# EAGLE design homecomputer-6502 (EAGLE 6.5.0)

## Sheet 1 of 4
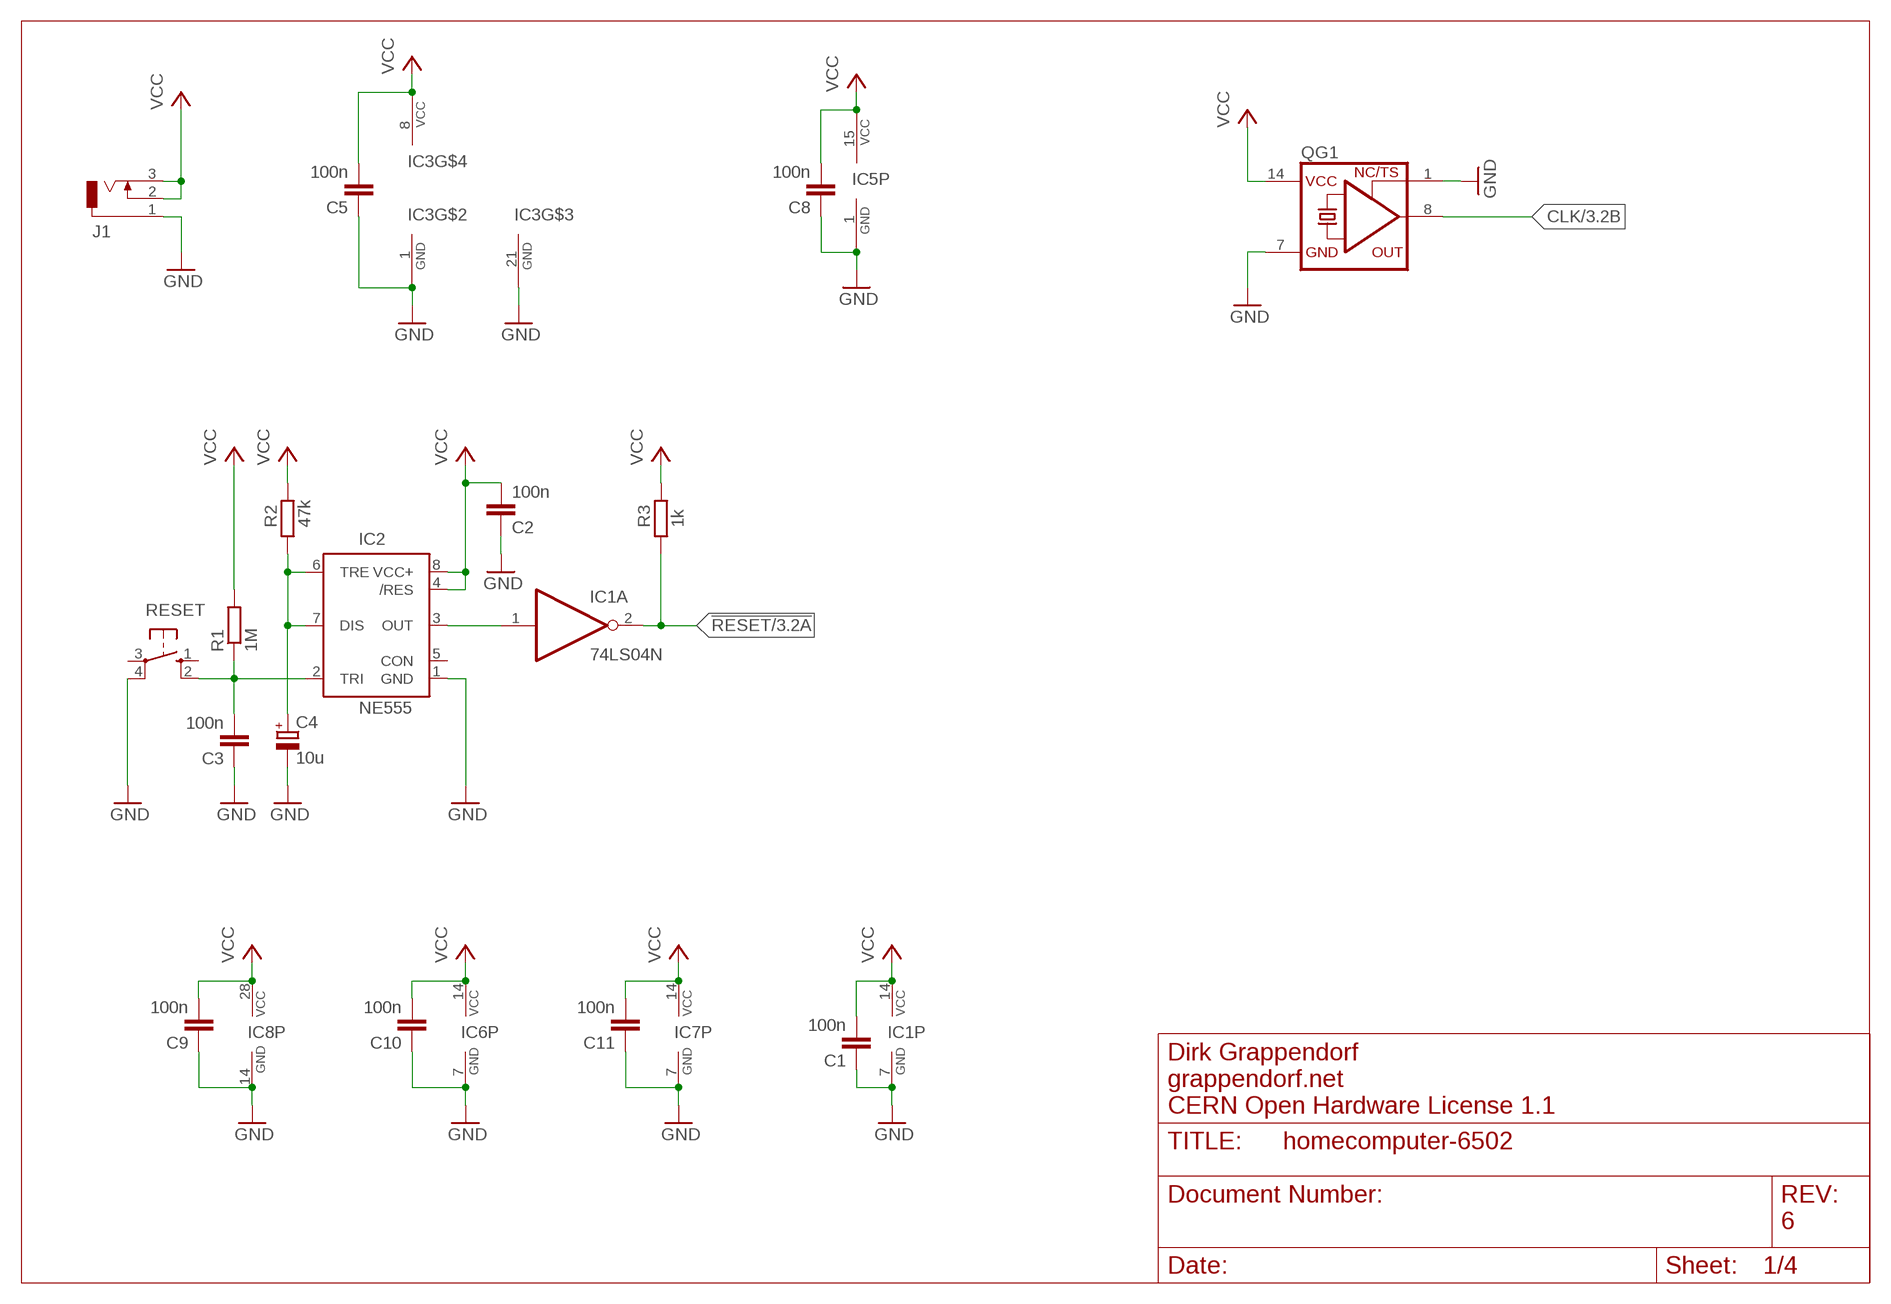
[diagram p0: schematic, sheet 1]

### Parts
C1  100n  C-EU025-024X044  [C025-024X044]
C2  100n  C-EU025-024X044  [C025-024X044]
C3  100n  C-EU025-024X044  [C025-024X044]
C4  10u  CPOL-EUE2,5-6E  [E2,5-6E]
C5  100n  C-EU025-024X044  [C025-024X044]
C8  100n  C-EU025-024X044  [C025-024X044]
C9  100n  C-EU025-024X044  [C025-024X044]
C10  100n  C-EU025-024X044  [C025-024X044]
C11  100n  C-EU025-024X044  [C025-024X044]
IC1  74LS04N  [DIL14]
IC2  NE555  [DIL-08]
IC3  6502  [DIP40]
IC5  6551  [DIP28]
IC6  74LS00N  [DIL14]
IC7  74LS30N  [DIL14]
IC8  61256  [DIL28-3]
J1  DCJ0303  [DCJ0303]
QG1  XO-14  [DIL14S]
R1  1M  R-EU_0204/5  [0204/5]
R2  47k  R-EU_0204/5  [0204/5]
R3  1k  R-EU_0204/5  [0204/5]
RESET  10-XX  [B3F-10XX]

### Nets
!RESET: IC1.2(A:O) R3.1 ; also sheet 3,4
CLK: QG1.8(OUT) ; also sheet 3
GND: C1.1 C2.1 C3.1 C4.- C5.1 C8.1 C9.1 C10.1 C11.1 IC1.7(P:GND) IC2.1(GND) IC3.1(GND) IC3.21(GND) IC5.1(GND) IC6.7(P:GND) IC7.7(GND) IC8.14(GND) J1.1 QG1.1(TS) QG1.7(GND) RESET.4(P1) ; also sheet 3,4
N$4: C4.+ IC2.6(TRE) IC2.7(DIS) R2.1
N$5: IC1.1(A:I) IC2.3(OUT)
N$6: C3.2 IC2.2(TRI) R1.1 RESET.2(S1)
VCC: C1.2 C2.2 C5.2 C8.2 C9.2 C10.2 C11.2 IC1.14(P:VCC) IC2.4(/RES) IC2.8(VCC+) IC3.8(VCC) IC5.15(VCC) IC6.14(P:VCC) IC7.14(VCC) IC8.28(VCC) J1.2 J1.3 QG1.14(VCC) R1.2 R2.2 R3.2 ; also sheet 3,4
Unconnected: IC1.5(C:I) IC1.6(C:O) IC1.8(D:O) IC1.9(D:I) IC1.12(F:O) IC1.13(F:I) IC2.5(CON) IC6.8(C:O) IC6.9(C:I0) IC6.10(C:I1) IC6.11(D:O) IC6.12(D:I0) IC6.13(D:I1) RESET.1(S) RESET.3(P)

### Notes on the sheet
- Dirk Grappendorf
- grappendorf.net
- CERN Open Hardware License 1.1
- 6

## Sheet 2 of 4
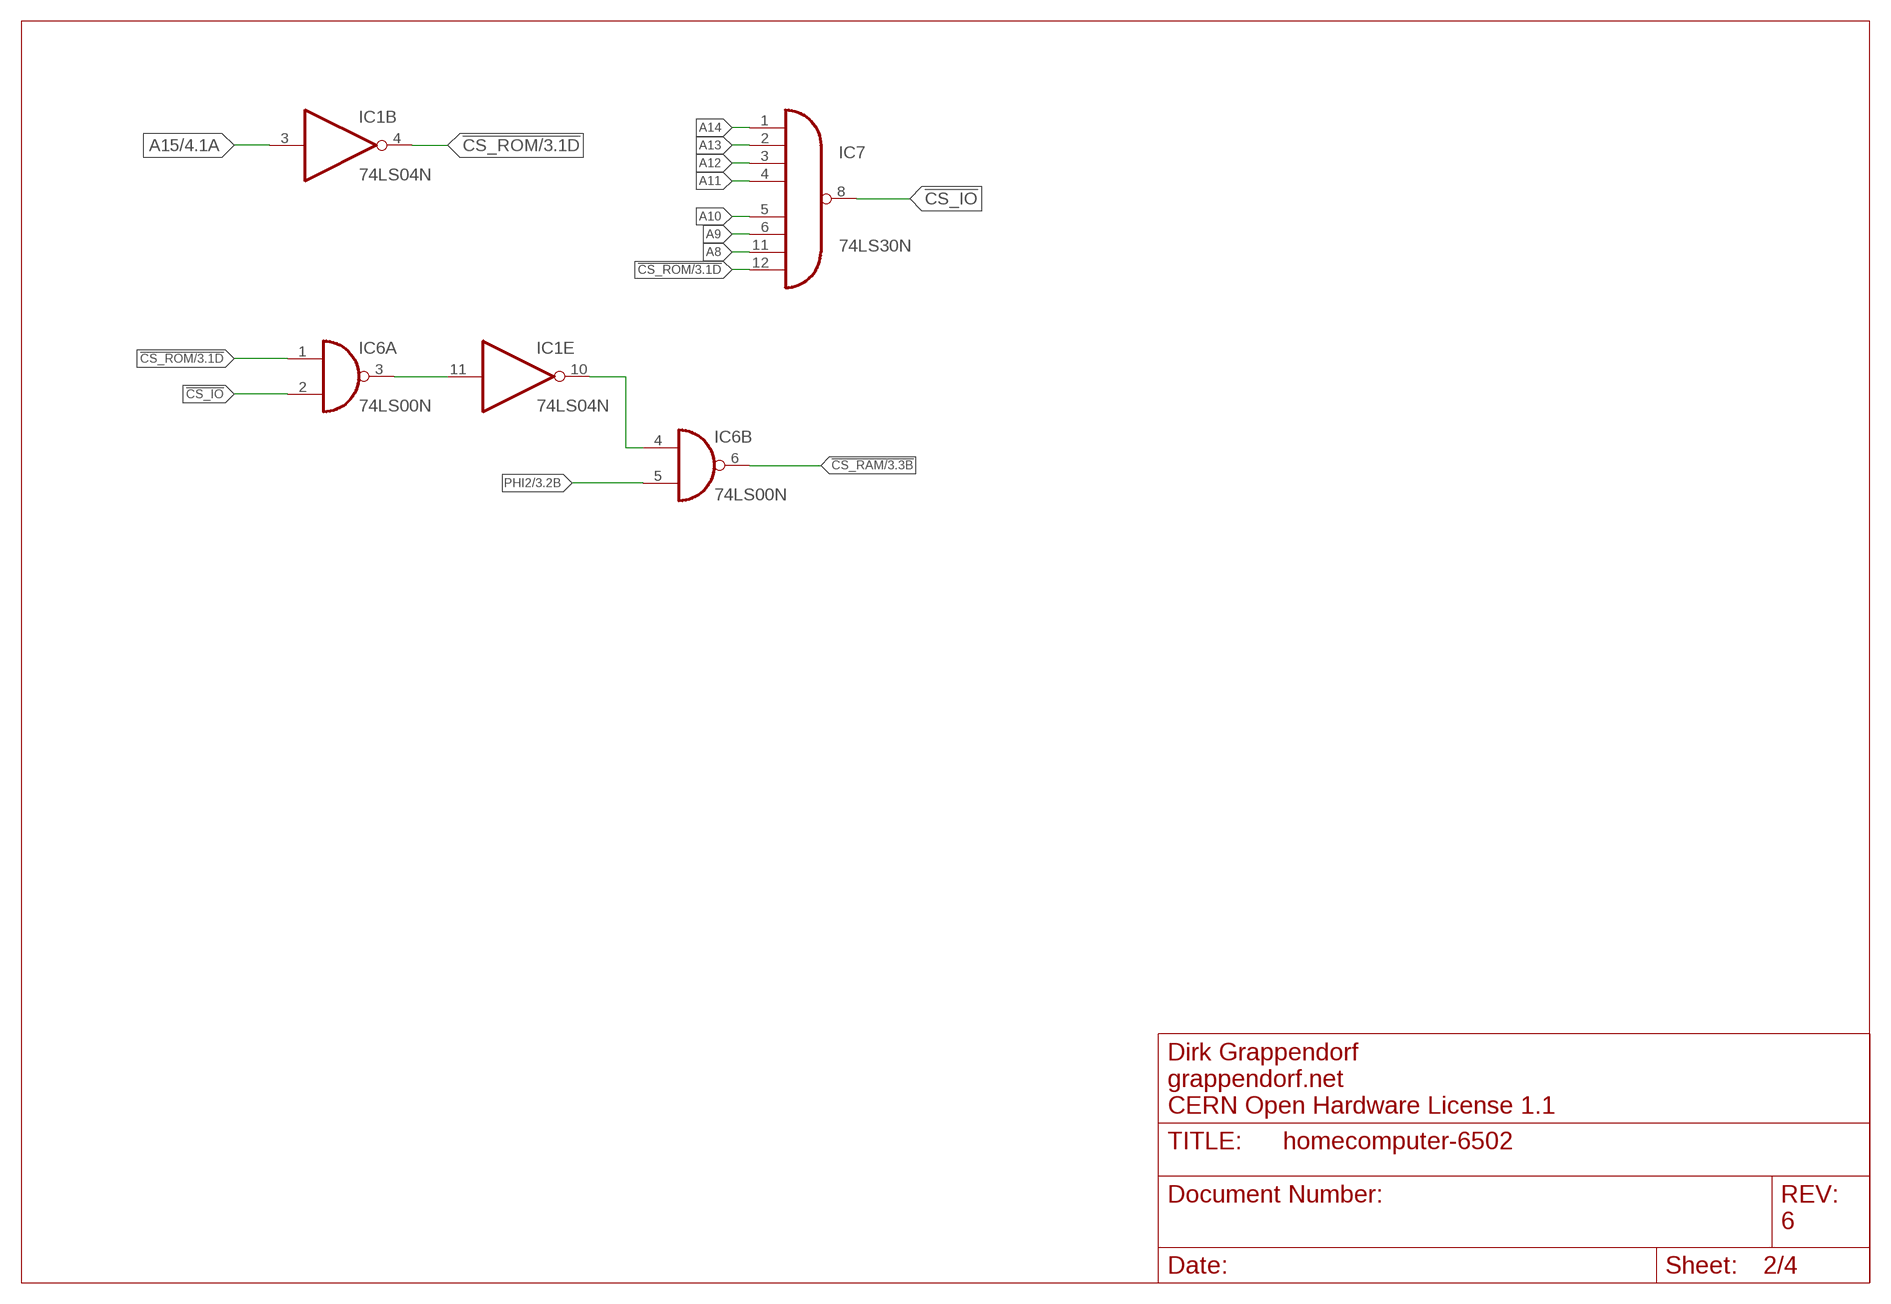
[diagram p1: schematic, sheet 2]

### Nets
!CS_IO: IC6.2(A:I1) IC7.8(O)
!CS_RAM: IC6.6(B:O) ; also sheet 3
!CS_ROM: IC1.4(B:O) IC6.1(A:I0) IC7.12(I7) ; also sheet 3
A8: IC7.11(I6) ; also sheet 3
A9: IC7.6(I5) ; also sheet 3
A10: IC7.5(I4) ; also sheet 3
A11: IC7.4(I3) ; also sheet 3
A12: IC7.3(I2) ; also sheet 3
A13: IC7.2(I1) ; also sheet 3
A14: IC7.1(I0) ; also sheet 3
A15: IC1.3(B:I) ; also sheet 3,4
N$14: IC1.11(E:I) IC6.3(A:O)
N$15: IC1.10(E:O) IC6.4(B:I0)
PHI2: IC6.5(B:I1) ; also sheet 3,4

### Notes on the sheet
- Dirk Grappendorf
- grappendorf.net
- CERN Open Hardware License 1.1
- 6

## Sheet 3 of 4
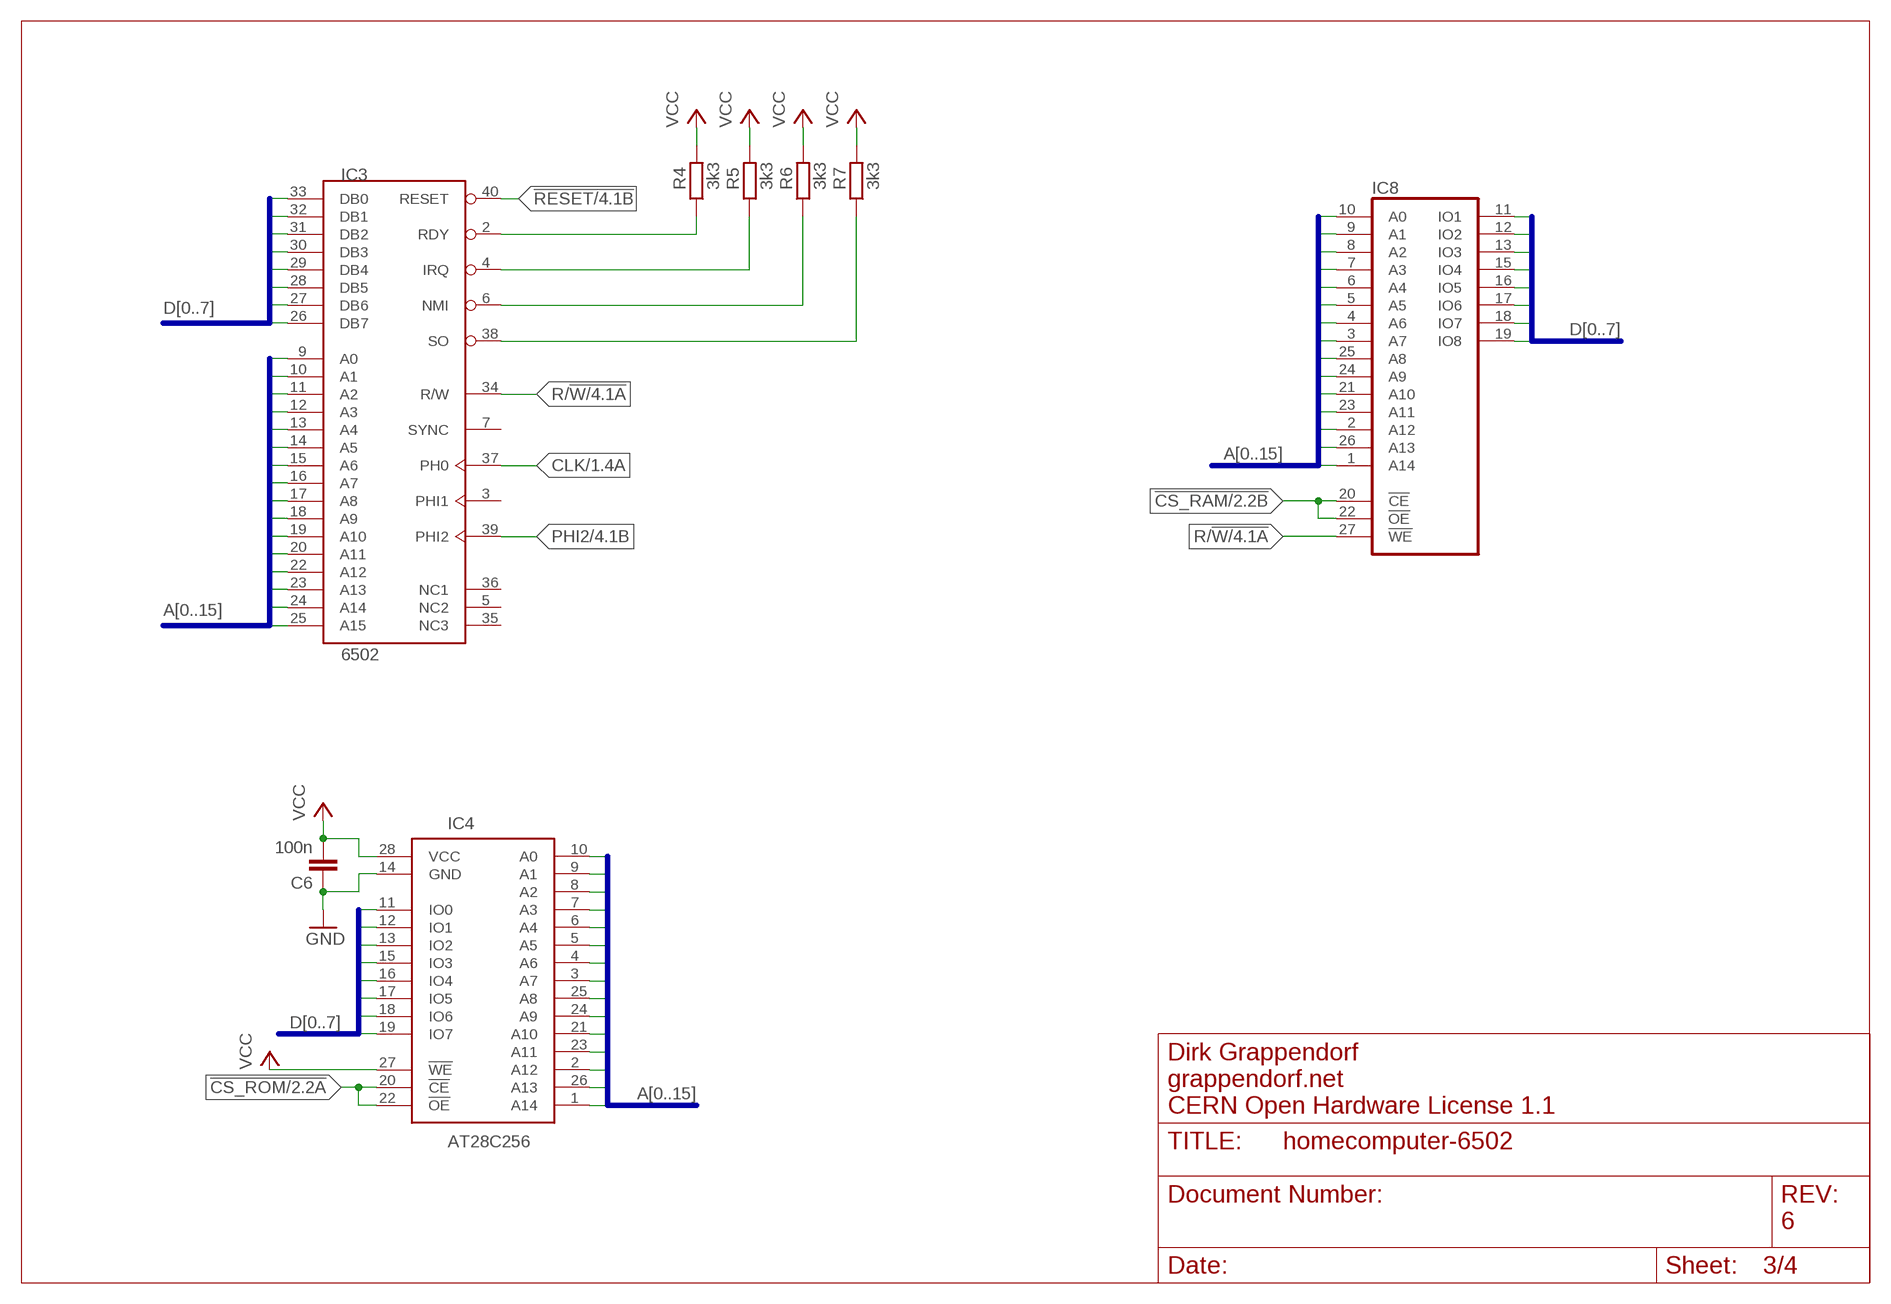
[diagram p2: schematic, sheet 3]

### Parts
C6  100n  C-EU025-024X044  [C025-024X044]
IC4  AT28C256  [DIL28-6]
R4  3k3  R-EU_0204/5  [0204/5]
R5  3k3  R-EU_0204/5  [0204/5]
R6  3k3  R-EU_0204/5  [0204/5]
R7  3k3  R-EU_0204/5  [0204/5]

### Nets
!CS_RAM: IC8.20(!CE) IC8.22(!OE) ; also sheet 2
!CS_ROM: IC4.20(!CE) IC4.22(!OE) ; also sheet 2
!RESET: IC3.40(RESET) ; also sheet 1,4
A0: IC3.9(A0) IC4.10(A0) IC8.10(A0) ; also sheet 4
A1: IC3.10(A1) IC4.9(A1) IC8.9(A1) ; also sheet 4
A2: IC3.11(A2) IC4.8(A2) IC8.8(A2)
A3: IC3.12(A3) IC4.7(A3) IC8.7(A3)
A4: IC3.13(A4) IC4.6(A4) IC8.6(A4)
A5: IC3.14(A5) IC4.5(A5) IC8.5(A5)
A6: IC3.15(A6) IC4.4(A6) IC8.4(A6)
A7: IC3.16(A7) IC4.3(A7) IC8.3(A7)
A8: IC3.17(A8) IC4.25(A8) IC8.25(A8) ; also sheet 2
A9: IC3.18(A9) IC4.24(A9) IC8.24(A9) ; also sheet 2
A10: IC3.19(A10) IC4.21(A10) IC8.21(A10) ; also sheet 2
A11: IC3.20(A11) IC4.23(A11) IC8.23(A11) ; also sheet 2
A12: IC3.22(A12) IC4.2(A12) IC8.2(A12) ; also sheet 2
A13: IC3.23(A13) IC4.26(A13) IC8.26(A13) ; also sheet 2
A14: IC3.24(A14) IC4.1(A14) IC8.1(A14) ; also sheet 2
A15: IC3.25(A15) ; also sheet 2,4
CLK: IC3.37(PH0) ; also sheet 1
D0: IC3.33(DB0) IC4.11(IO0) IC8.11(IO1) ; also sheet 4
D1: IC3.32(DB1) IC4.12(IO1) IC8.12(IO2) ; also sheet 4
D2: IC3.31(DB2) IC4.13(IO2) IC8.13(IO3) ; also sheet 4
D3: IC3.30(DB3) IC4.15(IO3) IC8.15(IO4) ; also sheet 4
D4: IC3.29(DB4) IC4.16(IO4) IC8.16(IO5) ; also sheet 4
D5: IC3.28(DB5) IC4.17(IO5) IC8.17(IO6) ; also sheet 4
D6: IC3.27(DB6) IC4.18(IO6) IC8.18(IO7) ; also sheet 4
D7: IC3.26(DB7) IC4.19(IO7) IC8.19(IO8) ; also sheet 4
GND: C6.1 IC4.14(GND) ; also sheet 1,4
N$3: IC3.2(RDY) R4.1
N$9: IC3.4(IRQ) R5.1
N$10: IC3.6(NMI) R6.1
N$11: IC3.38(SO) R7.1
PHI2: IC3.39(PHI2) ; also sheet 2,4
R/!W: IC3.34(R/W) IC8.27(!WE) ; also sheet 4
VCC: C6.2 IC4.27(!WE) IC4.28(VCC) R4.2 R5.2 R6.2 R7.2 ; also sheet 1,4
Unconnected: IC3.3(PHI1) IC3.5(NC2) IC3.7(SYNC) IC3.35(NC3) IC3.36(NC1)

### Buses
A[0..15]
D[0..7]

### Notes on the sheet
- Dirk Grappendorf
- grappendorf.net
- CERN Open Hardware License 1.1
- 6

## Sheet 4 of 4
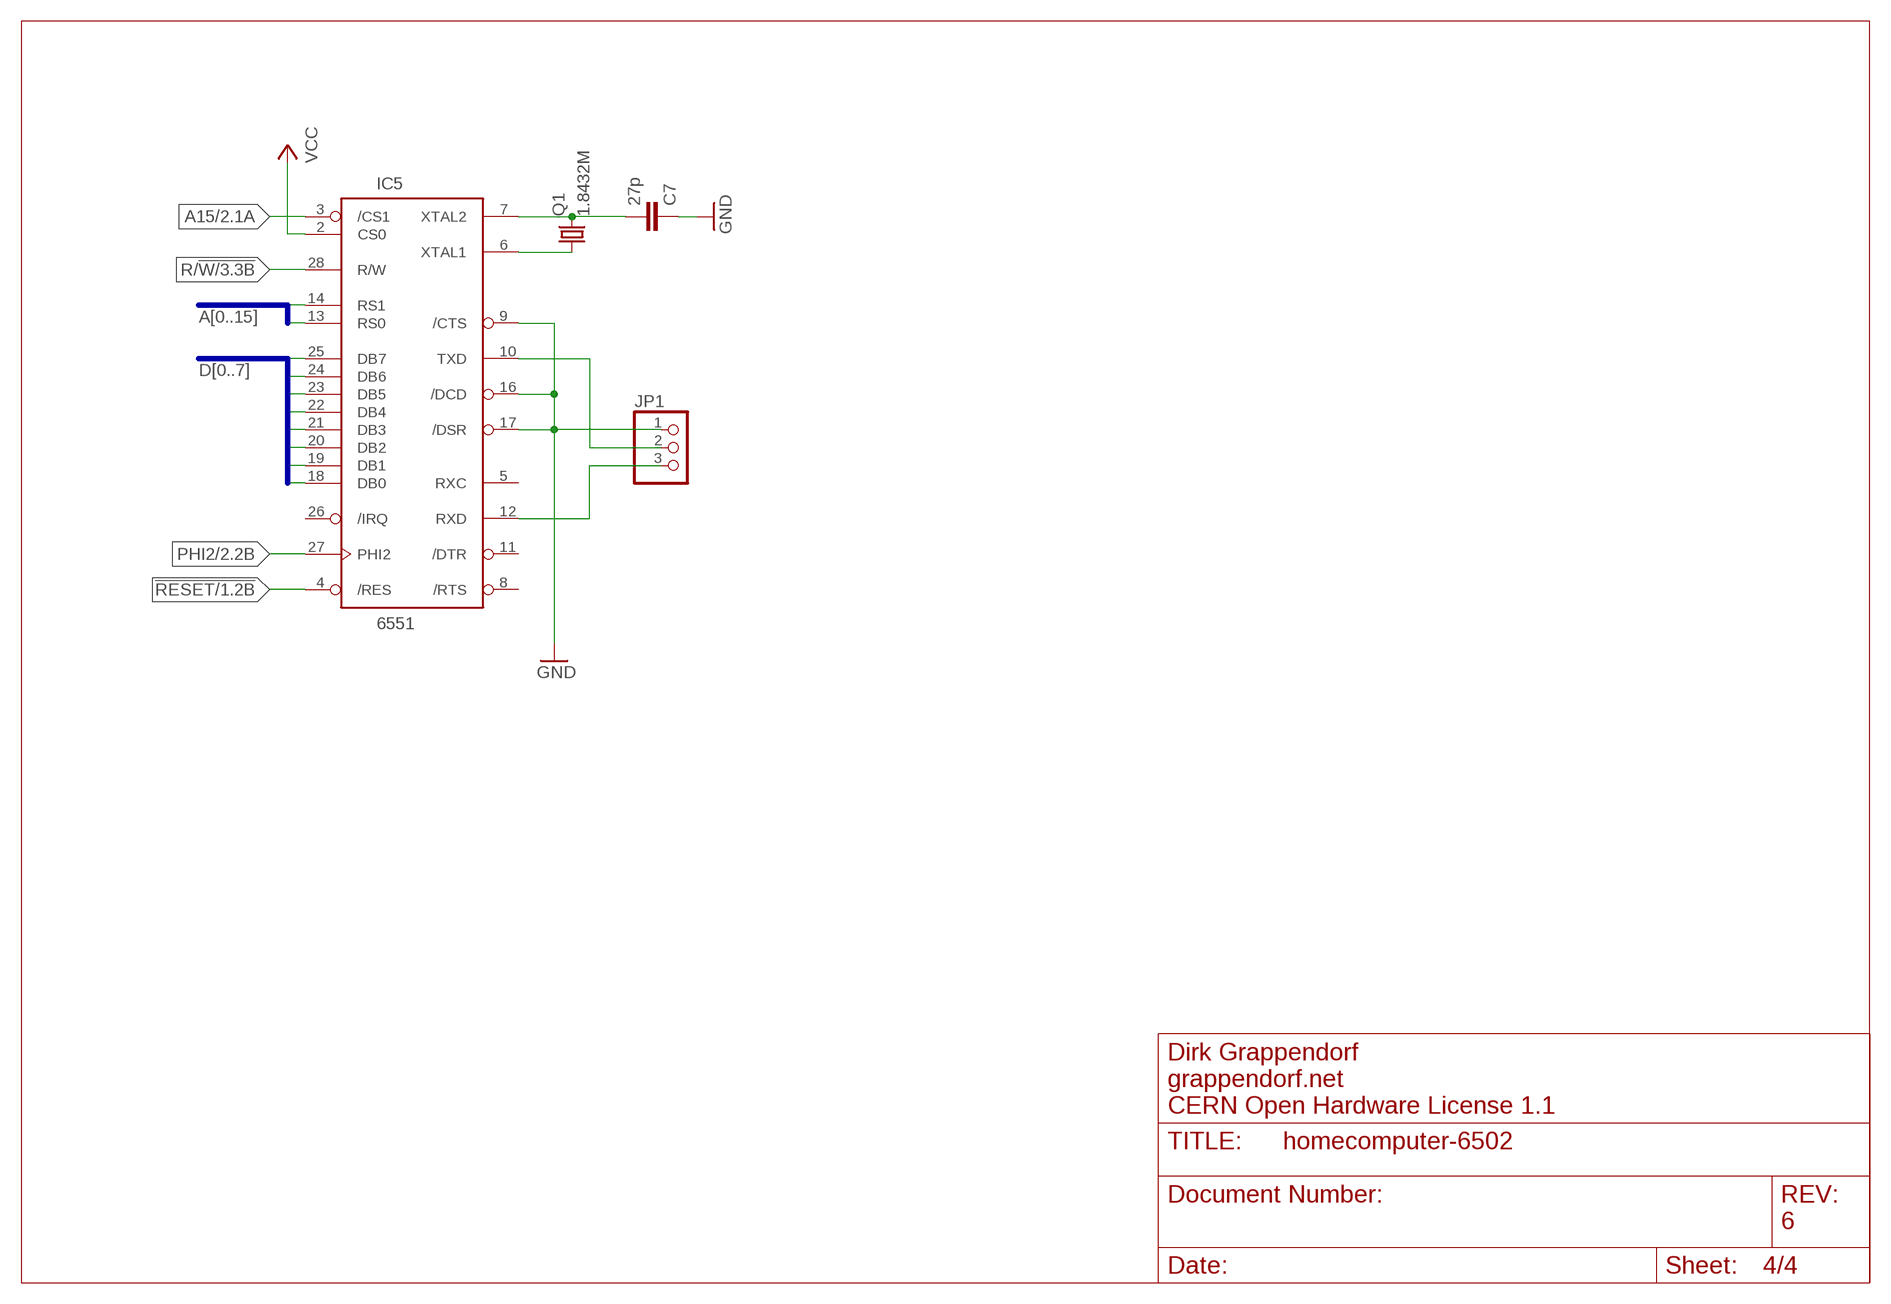
[diagram p3: schematic, sheet 4]

### Parts
C7  27p  C-EU025-024X044  [C025-024X044]
JP1  PINHD-1X3_2.54  [1X03]
Q1  1.8432M  CRYSTALHC49U-V  [HC49U-V]

### Nets
!RESET: IC5.4(/RES) ; also sheet 1,3
A0: IC5.13(RS0) ; also sheet 3
A1: IC5.14(RS1) ; also sheet 3
A15: IC5.3(/CS1) ; also sheet 2,3
D0: IC5.18(DB0) ; also sheet 3
D1: IC5.19(DB1) ; also sheet 3
D2: IC5.20(DB2) ; also sheet 3
D3: IC5.21(DB3) ; also sheet 3
D4: IC5.22(DB4) ; also sheet 3
D5: IC5.23(DB5) ; also sheet 3
D6: IC5.24(DB6) ; also sheet 3
D7: IC5.25(DB7) ; also sheet 3
GND: C7.1 IC5.9(/CTS) IC5.16(/DCD) IC5.17(/DSR) JP1.1 ; also sheet 1,3
N$1: C7.2 IC5.7(XTAL2) Q1.2
N$2: IC5.6(XTAL1) Q1.1
N$8: IC5.10(TXD) JP1.2
N$12: IC5.12(RXD) JP1.3
PHI2: IC5.27(PHI2) ; also sheet 2,3
R/!W: IC5.28(R/W) ; also sheet 3
VCC: IC5.2(CS0) ; also sheet 1,3
Unconnected: IC5.5(RXC) IC5.8(/RTS) IC5.11(/DTR) IC5.26(/IRQ)

### Buses
A[0..15]
D[0..7]

### Notes on the sheet
- Dirk Grappendorf
- grappendorf.net
- CERN Open Hardware License 1.1
- 6

## Library data of the parts
C1-C3 C5-C11 = rcl:C-EU: CAPACITOR, European symbol
C4 = rcl:CPOL-EU: POLARIZED CAPACITOR, European symbol
IC1 = 74xx-eu:74*04: Hex INVERTER
IC2 = st-microelectronics:NE555: General purpose bipolar Timer; MF: Arrow Electronics; MPN: NE555N; OC_FARNELL: 1467742; OC_NEWARK: 89K1486
IC3 = 6502:6502: 6502 processor
IC4 = atmel-28c:AT28C256: EEPROM 32Kx8 256k bit The AT28C256 is a high-performance Electrically Erasable and Programmable Read Only Memory. Its 256K of memory is organized as 32,768 words by 8 bits.
IC5 = 6502:6551: ACIA. Capable of RS-232
IC6 = 74xx-eu:74*00: Quad 2-input NAND gate
IC7 = 74xx-eu:74*30: 8-input NAND gate
IC8 = grapelabs:61256: MEMORY
J1 = con-jack:DCJ0303: DC POWER JACK Source: DCJ0303.pdf; OC_FARNELL: unknown; OC_NEWARK: unknown
JP1 = pinhead-1:PINHD-1X3: PIN HEADER
Q1 = crystal:CRYSTAL: CRYSTAL; OC_FARNELL: 1666969; OC_NEWARK: unknown
QG1 = crystal2:XO-: CRYSTAL
R1-R7 = rcl:R-EU_: RESISTOR, European symbol
RESET = switch-omron:10-XX: OMRON SWITCH; MPN: B3F-1000; OC_FARNELL: 176432; OC_NEWARK: 36M3542

## Board
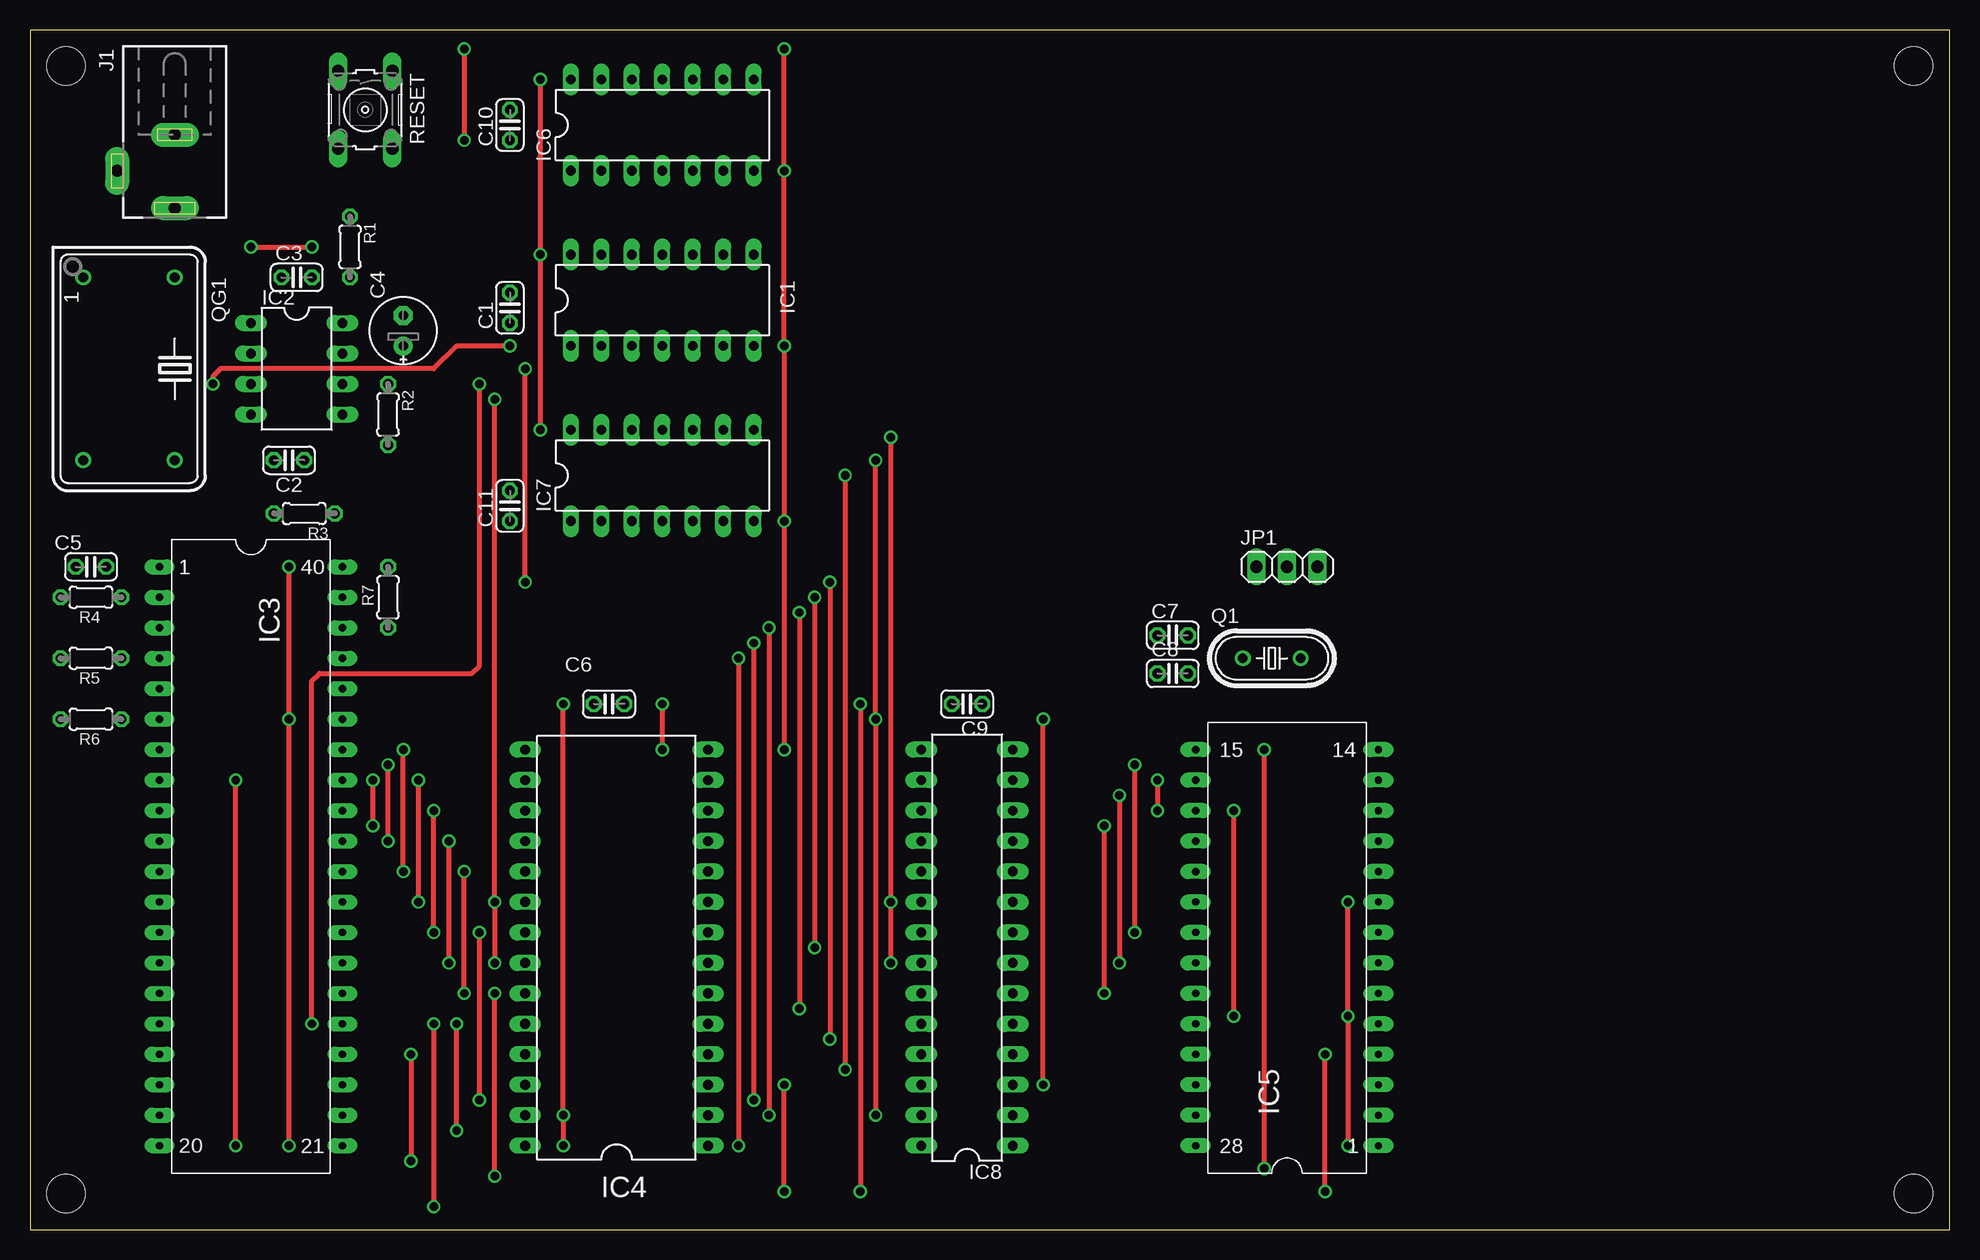
[diagram p4: board, top side]
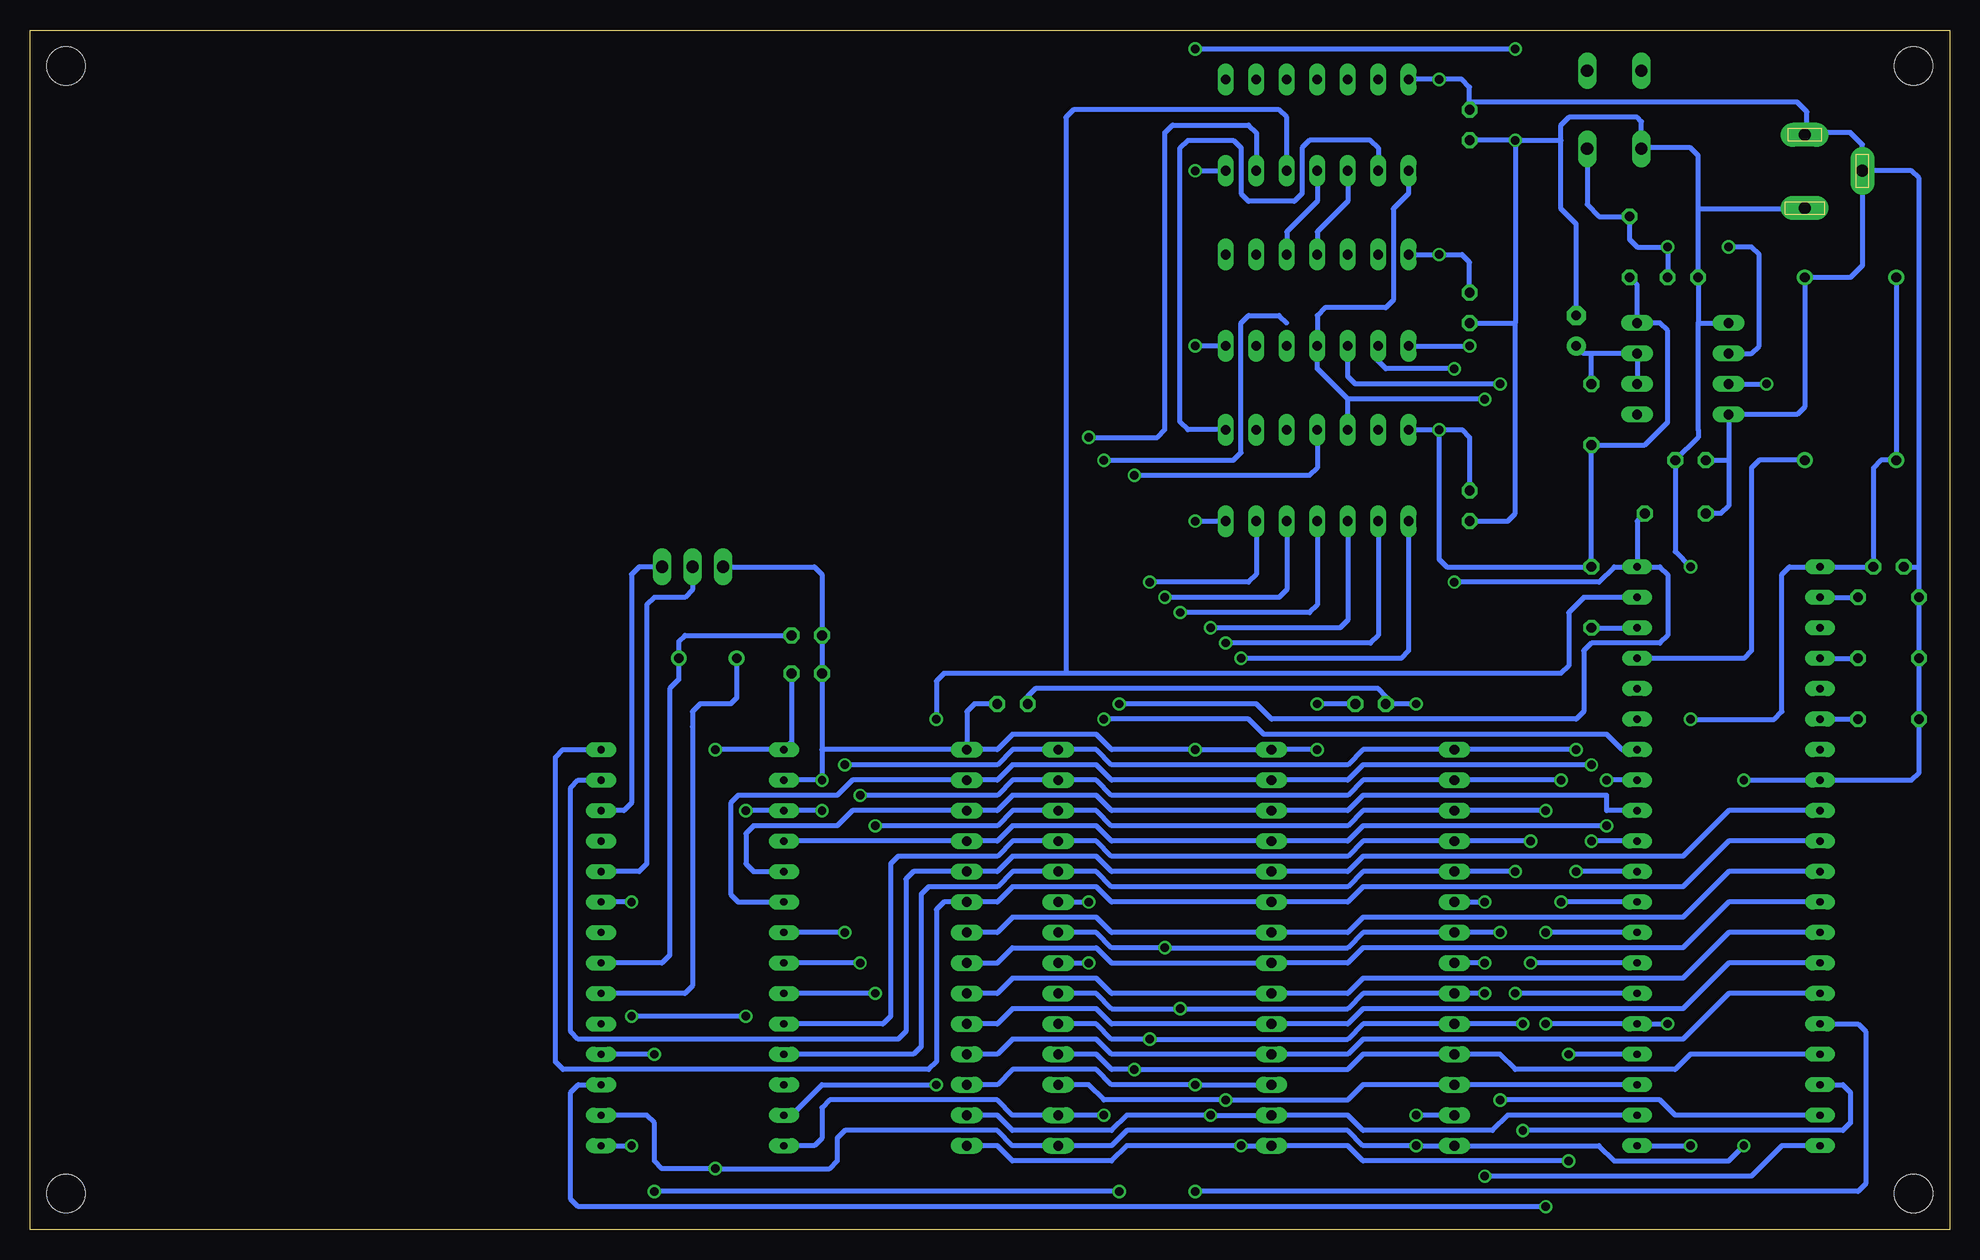
[diagram p5: board, bottom side, seen from below]

Size 160 x 100 mm. Coordinates in mm from the lower left corner, seen from the top.
Outline: 0,0 160,0 160,100 0,100 0,0
Copper layers (1*2*16): Top 0.035mm / dielectric 0.75mm / Route2 0.035mm / dielectric 0.75mm / Bottom 0.035mm
Design rules "default *": minimum track width 10mil, minimum drill 24mil, track to track 8mil, track to pad 8mil, pad to pad 8mil, via to via 8mil, smd to smd 8mil, copper to edge 40mil, drill to drill 8mil, minimum pad ring 10mil, minimum via ring 8mil, stop-mask expansion 4mil, vias tented up to drill 0mil, thermal gap 10mil
Holes 3.2 mm at 3,97 157,97 3,3 157,3

### Footprints (pad centres in the part's own frame; a part is rotated, then mirrored left to right if it is on the bottom)
C025-024X044 = drill 0.813 octagon: 1 -1.27,0; 2 1.27,0
E2,5-6E = drill 0.813 pad 1.575: + -1.27,0 | drill 0.813 pad 1.575 octagon: - 1.27,0
DIL14 = drill 0.813 long: 1 -7.62,-3.81; 2 -5.08,-3.81; 3 -2.54,-3.81; 4 0,-3.81; 5 2.54,-3.81; 6 5.08,-3.81; 7 7.62,-3.81; 8 7.62,3.81; 9 5.08,3.81; 10 2.54,3.81; 11 0,3.81; 12 -2.54,3.81; 13 -5.08,3.81; 14 -7.62,3.81
DIL-08 = drill 0.813 long: 1 -3.81,-3.81; 2 -1.27,-3.81; 3 1.27,-3.81; 4 3.81,-3.81; 5 3.81,3.81; 6 1.27,3.81; 7 -1.27,3.81; 8 -3.81,3.81
DIP40 = drill 0.61 pad 1.27 long: 1 -24.13,-7.62; 2 -21.59,-7.62; 3 -19.05,-7.62; 4 -16.51,-7.62; 5 -13.97,-7.62; 6 -11.43,-7.62; 7 -8.89,-7.62; 8 -6.35,-7.62; 9 -3.81,-7.62; 10 -1.27,-7.62; 11 1.27,-7.62; 12 3.81,-7.62; 13 6.35,-7.62; 14 8.89,-7.62; 15 11.43,-7.62; 16 13.97,-7.62; 17 16.51,-7.62; 18 19.05,-7.62; 19 21.59,-7.62; 20 24.13,-7.62; 21 24.13,7.62; 22 21.59,7.62; 23 19.05,7.62; 24 16.51,7.62; 25 13.97,7.62; 26 11.43,7.62; 27 8.89,7.62; 28 6.35,7.62; 29 3.81,7.62; 30 1.27,7.62; 31 -1.27,7.62; 32 -3.81,7.62; 33 -6.35,7.62; 34 -8.89,7.62; 35 -11.43,7.62; 36 -13.97,7.62; 37 -16.51,7.62; 38 -19.05,7.62; 39 -21.59,7.62; 40 -24.13,7.62
DIL28-6 = drill 0.813 long: 1 -16.51,-7.62; 2 -13.97,-7.62; 3 -11.43,-7.62; 4 -8.89,-7.62; 5 -6.35,-7.62; 6 -3.81,-7.62; 7 -1.27,-7.62; 8 1.27,-7.62; 9 3.81,-7.62; 10 6.35,-7.62; 11 8.89,-7.62; 12 11.43,-7.62; 13 13.97,-7.62; 14 16.51,-7.62; 15 16.51,7.62; 16 13.97,7.62; 17 11.43,7.62; 18 8.89,7.62; 19 6.35,7.62; 20 3.81,7.62; 21 1.27,7.62; 22 -1.27,7.62; 23 -3.81,7.62; 24 -6.35,7.62; 25 -8.89,7.62; 26 -11.43,7.62; 27 -13.97,7.62; 28 -16.51,7.62
DIP28 = drill 0.61 pad 1.27 long: 1 -16.51,-7.62; 2 -13.97,-7.62; 3 -11.43,-7.62; 4 -8.89,-7.62; 5 -6.35,-7.62; 6 -3.81,-7.62; 7 -1.27,-7.62; 8 1.27,-7.62; 9 3.81,-7.62; 10 6.35,-7.62; 11 8.89,-7.62; 12 11.43,-7.62; 13 13.97,-7.62; 14 16.51,-7.62; 15 16.51,7.62; 16 13.97,7.62; 17 11.43,7.62; 18 8.89,7.62; 19 6.35,7.62; 20 3.81,7.62; 21 1.27,7.62; 22 -1.27,7.62; 23 -3.81,7.62; 24 -6.35,7.62; 25 -8.89,7.62; 26 -11.43,7.62; 27 -13.97,7.62; 28 -16.51,7.62
DIL28-3 = drill 0.813 long: 1 -16.51,-3.81; 2 -13.97,-3.81; 3 -11.43,-3.81; 4 -8.89,-3.81; 5 -6.35,-3.81; 6 -3.81,-3.81; 7 -1.27,-3.81; 8 1.27,-3.81; 9 3.81,-3.81; 10 6.35,-3.81; 11 8.89,-3.81; 12 11.43,-3.81; 13 13.97,-3.81; 14 16.51,-3.81; 15 16.51,3.81; 16 13.97,3.81; 17 11.43,3.81; 18 8.89,3.81; 19 6.35,3.81; 20 3.81,3.81; 21 1.27,3.81; 22 -1.27,3.81; 23 -3.81,3.81; 24 -6.35,3.81; 25 -8.89,3.81; 26 -11.43,3.81; 27 -13.97,3.81; 28 -16.51,3.81
DCJ0303 = drill 1 pad 2 long: 1 0,3.1; 2 4.8,0; 3 0,-3
1X03 = drill 1.016 long: 1 -2.54,0; 2 0,0; 3 2.54,0
HC49U-V = drill 0.813: 1 -2.413,0; 2 2.413,0
DIL14S = drill 0.813: 1 -7.62,-3.81; 7 7.62,-3.81; 8 7.62,3.81; 14 -7.62,3.81
0204/5 = drill 0.813 octagon: 1 -2.54,0; 2 2.54,0
B3F-10XX = drill 1.016 long: 1 -3.251,2.261; 2 3.251,2.261; 3 -3.251,-2.261; 4 3.251,-2.261

### Placement (x,y rotation side)
C1  40.01,76.83 90 top
C2  21.59,64.14 180 top
C3  22.23,79.38 0 top
C4  31.11,74.93 90 top
C5  5.08,55.24 180 top
C6  48.26,43.81 180 top
C7  95.25,49.53 0 top
C8  95.25,46.35 0 top
C9  78.11,43.81 180 top
C10  40.01,92.08 90 top
C11  40.01,60.33 90 top
IC1  52.7,77.47 0 top
IC2  22.23,71.75 270 top
IC3  18.41,31.11 270 top
IC4  48.9,23.5 90 top
IC5  104.78,23.5 90 top
IC6  52.7,92.08 0 top
IC7  52.7,62.87 0 top
IC8  78.11,23.5 90 top
J1  12.06,88.27 180 top
JP1  104.78,55.24 0 top
Q1  103.5,47.62 0 top
QG1  8.26,71.75 270 top
R1  26.67,81.92 270 top
R2  29.84,67.94 270 top
R3  22.86,59.69 180 top
R4  5.08,52.7 180 top
R5  5.08,47.62 180 top
R6  5.08,42.55 180 top
R7  29.84,52.7 90 top
RESET  27.94,93.34 270 top

### Tracks (layer width: path | path; a pad name or v marks a point on that pad's centre or on a via)
!CS_IO
  Bottom 0.406: IC7.8 63.5,66.67 64.14,67.31 64.14,90.17 63.5,90.81 59.69,90.81 59.05,90.17 59.05,86.36 58.42,85.72 54.61,85.72 53.98,86.36 53.98,90.17 53.34,90.81 48.26,90.81 47.62,90.17 IC6.2
!CS_RAM  (via drill 0.7)
  Top 0.406: v71.75,66.04 v71.75,27.3 v71.75,22.23
  Bottom 0.406: IC8.20 v71.75,27.3 | v71.75,66.04 66.04,66.04 65.41,66.67 65.41,91.44 64.77,92.08 58.42,92.08 57.78,91.44 IC6.6 | IC8.22 v71.75,22.23
!CS_ROM  (via drill 0.7)
  Top 0.406: v38.73,69.22 v38.73,27.3 v38.73,22.23
  Bottom 0.406: IC4.20 v38.73,27.3 | v38.73,69.22 50.16,69.22 | 50.16,69.22 52.7,71.75 IC1.4 52.7,76.2 52.07,76.83 46.99,76.83 46.35,77.47 46.35,85.09 45.09,86.36 IC6.1 | IC7.12 50.16,69.22 | v38.73,22.23 IC4.22
!RESET  (via drill 0.7)
  Top 0.406: v69.22,43.81 v69.22,3.17 | v107.95,3.17 v107.95,14.61 | v41.27,53.98 v41.27,71.75
  Bottom 0.406: R3.1 26.04,59.05 IC3.40 | IC3.40 24.13,55.24 23.5,54.61 23.5,49.53 24.13,48.9 29.84,48.9 30.48,48.26 30.48,43.18 31.11,42.55 56.52,42.55 57.78,43.81 v69.22,43.81 | v69.22,3.17 v107.95,3.17 | v107.95,14.61 IC5.4 | IC3.40 27.94,55.24 29.21,53.98 v41.27,53.98 | v41.27,71.75 46.99,71.75 47.62,72.39 IC1.2
A0
  Bottom 0.406: IC3.9 18.41,34.92 22.23,31.11 48.9,31.11 50.16,29.84 IC4.10 69.85,29.84 71.12,31.11 78.11,31.11 79.38,29.84 IC8.10 86.36,29.84 87,29.21 87,16.51 87.63,15.88 114.3,15.88 114.94,16.51 114.94,36.83 114.3,37.47 IC5.13
A1
  Bottom 0.406: IC3.10 18.41,32.38 22.23,28.57 48.9,28.57 50.16,27.3 IC4.9 69.85,27.3 71.12,28.57 78.11,28.57 79.38,27.3 IC8.9 83.82,27.3 84.45,26.67 84.45,13.97 85.09,13.34 115.57,13.34 116.2,13.97 116.2,39.37 115.57,40.01 IC5.14
A2
  Bottom 0.406: IC3.11 18.41,29.84 22.23,26.04 48.9,26.04 50.16,24.77 IC4.8 69.85,24.77 71.12,26.04 78.11,26.04 79.38,24.77 IC8.8
A3
  Bottom 0.406: IC3.12 18.41,27.3 22.23,23.5 48.9,23.5 50.16,22.23 IC4.7 69.85,22.23 71.12,23.5 78.11,23.5 79.38,22.23 IC8.7
A4
  Bottom 0.406: IC3.13 18.41,24.77 22.23,20.95 48.9,20.95 50.16,19.68 IC4.6 69.85,19.68 71.12,20.95 78.11,20.95 79.38,19.68 IC8.6
A5
  Bottom 0.406: IC3.14 18.41,22.23 22.23,18.41 48.9,18.41 50.16,17.14 IC4.5 69.85,17.14 71.12,18.41 78.11,18.41 79.38,17.14 IC8.5
A6
  Bottom 0.406: IC3.15 18.41,19.68 22.23,15.88 48.9,15.88 50.16,14.61 IC4.4 69.85,14.61 71.12,15.88 78.11,15.88 79.38,14.61 IC8.4
A7  (via drill 0.7)
  Top 0.406: v62.87,3.17 v62.87,12.06
  Bottom 0.406: IC8.3 79.38,12.06 78.11,13.34 71.12,13.34 69.85,12.06 v62.87,12.06 IC4.3 | IC3.16 7.62,17.14 6.99,16.51 6.99,3.81 7.62,3.17 v62.87,3.17
A8  (via drill 0.7)
  Top 0.406: v67.94,62.87 v67.94,13.34
  Bottom 0.406: IC3.17 21.59,14.61 22.86,13.34 36.2,13.34 37.47,14.61 IC4.25 48.9,14.61 50.16,13.34 v67.94,13.34 69.85,13.34 71.12,14.61 IC8.25 | IC7.11 52.7,63.5 53.34,62.87 v67.94,62.87
A9  (via drill 0.7)
  Top 0.406: v35.56,8.26 v35.56,17.14 | v66.67,53.98 v66.67,15.88
  Bottom 0.406: IC8.24 71.12,17.14 69.85,15.88 v66.67,15.88 50.16,15.88 48.9,17.14 IC4.24 v35.56,17.14 | IC3.18 8.89,12.06 8.26,11.43 8.26,8.89 8.89,8.26 v35.56,8.26 | IC7.6 57.78,54.61 58.42,53.98 v66.67,53.98
A10  (via drill 0.7)
  Top 0.406: v37.47,10.79 v37.47,24.77 | v65.41,52.7 v65.41,23.5
  Bottom 0.406: IC8.21 71.12,24.77 69.85,23.5 v65.41,23.5 50.16,23.5 48.9,24.77 IC4.21 v37.47,24.77 | IC3.19 22.86,9.53 24.13,10.79 v37.47,10.79 | IC7.5 55.24,53.34 55.88,52.7 v65.41,52.7
A11  (via drill 0.7)
  Top 0.406: v38.73,4.45 v38.73,19.68 | v64.14,51.44 v64.14,18.41
  Bottom 0.406: IC8.23 71.12,19.68 69.85,18.41 v64.14,18.41 50.16,18.41 48.9,19.68 IC4.23 v38.73,19.68 | IC3.20 13.97,6.99 16.51,4.45 v38.73,4.45 | IC7.4 52.7,52.07 53.34,51.44 v64.14,51.44
A12  (via drill 0.7)
  Top 0.406: v61.59,50.16 v61.59,9.53
  Bottom 0.406: IC3.22 36.83,9.53 38.1,8.26 48.9,8.26 50.16,9.53 IC4.2 v61.59,9.53 68.58,9.53 69.85,8.26 78.11,8.26 79.38,9.53 IC8.2 | IC7.3 50.16,50.8 50.8,50.16 v61.59,50.16
A13  (via drill 0.7)
  Top 0.406: v60.33,48.9 v60.33,10.79
  Bottom 0.406: IC3.23 IC4.26 48.9,12.06 50.16,10.79 v60.33,10.79 70.48,10.79 71.75,12.06 IC8.26 | IC7.2 47.62,49.53 48.26,48.9 v60.33,48.9
A14  (via drill 0.7)
  Top 0.406: v31.75,14.61 v31.75,5.71 | v59.05,47.62 v59.05,6.99
  Bottom 0.406: IC8.1 79.38,6.99 78.11,5.71 69.85,5.71 68.58,6.99 v59.05,6.99 IC4.1 50.16,6.99 48.9,5.71 v31.75,5.71 | IC3.24 v31.75,14.61 | IC7.1 45.09,48.26 45.72,47.62 v59.05,47.62
A15  (via drill 0.7)
  Top 0.406: v33.66,17.14 v33.66,1.91 | v23.5,17.14 23.5,45.72 24.13,46.35 36.83,46.35 37.47,46.99 v37.47,70.48
  Bottom 0.406: v33.66,17.14 IC3.25 v23.5,17.14 | v33.66,1.91 114.3,1.91 114.94,2.54 114.94,11.43 114.3,12.06 IC5.3 | v37.47,70.48 49.53,70.48 50.16,71.12 IC1.3
CLK
  Bottom 0.406: QG1.8 15.88,64.14 16.51,63.5 16.51,48.26 17.14,47.62 IC3.37
D0  (via drill 0.7)
  Top 0.406: v28.57,37.47 v28.57,33.66
  Bottom 0.406: IC3.33 v28.57,37.47 | v28.57,33.66 48.9,33.66 50.16,32.38 IC4.11 69.85,32.38 71.12,33.66 78.11,33.66 79.38,32.38 IC8.11 IC5.18
D1
  Bottom 0.406: IC3.32 28.57,34.92 28.57,36.2 48.9,36.2 50.16,34.92 IC4.12 69.85,34.92 71.12,36.2 78.11,36.2 79.38,34.92 IC8.12 91.44,34.92 92.71,33.66 99.69,33.66 100.33,33.02 100.33,30.48 99.69,29.84 IC5.19
D2  (via drill 0.7)
  Top 0.406: v29.84,32.38 v29.84,38.73
  Bottom 0.406: IC3.31 v29.84,32.38 | v29.84,38.73 48.9,38.73 50.16,37.47 IC4.13 69.85,37.47 71.12,38.73 78.11,38.73 79.38,37.47 IC8.13 91.44,37.47 92.71,36.2 100.97,36.2 101.6,35.56 101.6,27.94 100.97,27.3 IC5.20
D3  (via drill 0.7)
  Top 0.406: v92.08,38.73 v92.08,24.77 | v31.11,29.84 v31.11,40.01
  Bottom 0.406: IC3.30 v31.11,29.84 | v92.08,38.73 79.38,38.73 78.11,40.01 IC8.15 71.12,40.01 69.85,38.73 50.16,38.73 48.9,40.01 IC4.15 v31.11,40.01 | v92.08,24.77 IC5.21
D4  (via drill 0.7)
  Top 0.406: v32.38,27.3 v32.38,37.47 | v90.81,36.2 v90.81,22.23
  Bottom 0.406: IC3.29 v32.38,27.3 | v32.38,37.47 IC4.16 48.9,37.47 50.16,36.2 69.85,36.2 71.12,37.47 IC8.16 78.11,37.47 79.38,36.2 v90.81,36.2 | v90.81,22.23 IC5.22
D5  (via drill 0.7)
  Top 0.406: v33.66,24.77 v33.66,34.92 | v89.53,33.66 v89.53,19.68
  Bottom 0.406: IC3.28 v33.66,24.77 | v33.66,34.92 IC4.17 48.9,34.92 50.16,33.66 69.85,33.66 71.12,34.92 IC8.17 78.11,34.92 79.38,33.66 v89.53,33.66 | v89.53,19.68 IC5.23
D6  (via drill 0.7)
  Top 0.406: v34.92,22.23 v34.92,32.38
  Bottom 0.406: IC3.27 v34.92,22.23 | v34.92,32.38 IC4.18 48.9,32.38 50.16,31.11 69.85,31.11 71.12,32.38 IC8.18 78.11,32.38 79.38,31.11 87.63,31.11 88.27,30.48 88.27,17.78 88.9,17.14 IC5.24
D7  (via drill 0.7)
  Top 0.406: v36.2,19.68 v36.2,29.84
  Bottom 0.406: IC3.26 v36.2,19.68 | v36.2,29.84 IC4.19 48.9,29.84 50.16,28.57 69.85,28.57 71.12,29.84 IC8.19 78.11,29.84 79.38,28.57 85.09,28.57 85.72,27.94 85.72,15.24 86.36,14.61 IC5.25
GND  (via drill 0.7)
  Top 0.406: v93.98,37.47 v93.98,34.92 | v21.59,6.99 v21.59,42.53 v21.59,55.24 | v52.7,43.81 v52.7,40.01 | v62.87,40.01 v62.87,59.05 v62.87,73.66 v62.87,88.27 v62.87,98.42 | v100.33,34.92 v100.33,17.78 | v109.86,27.3 v109.86,17.78 v109.86,6.99 | v36.2,98.42 v36.2,90.81
  Bottom 0.406: IC8.14 79.38,40.01 78.11,41.27 71.12,41.27 69.85,40.01 v62.87,40.01 IC4.14 v52.7,40.01 | 20.95,85.09 12.14,85.09 J1.1 | 20.95,85.09 C3.1 20.95,75.56 | 20.95,75.56 IC2.1 | QG1.1 QG1.7 5.71,64.14 6.35,63.5 C5.1 IC3.1 13.34,55.24 13.97,54.61 13.97,43.18 14.62,42.53 v21.59,42.53 | 20.95,75.56 20.95,66.67 20.95,66.04 C2.1 22.86,56.52 v21.59,55.24 | IC5.16 v93.98,37.47 93.98,40.01 | v93.98,34.92 IC5.17 v100.33,34.92 | C11.1 36.83,59.05 36.2,59.69 36.2,75.56 | C4.- 31.11,76.83 | 31.11,76.83 31.11,83.82 32.38,85.09 32.38,90.81 | 32.38,90.81 32.38,92.08 31.75,92.71 26.04,92.71 25.68,92.35 RESET.4 25.6,90.17 21.59,90.17 20.95,89.53 20.95,85.09 | 31.65,76.3 31.11,76.83 | IC3.21 v21.59,6.99 | C9.1 81.28,43.81 81.92,43.18 IC8.14 | C6.1 v52.7,43.81 | IC5.1 v109.86,6.99 | v109.86,27.3 IC5.9 | IC8.14 93.98,40.01 | JP1.1 94.61,55.24 93.98,54.61 C7.1 C8.1 93.98,40.01 | v62.87,59.05 IC7.7 | IC1.7 v62.87,73.66 | v100.33,17.78 v109.86,17.78 | C1.1 36.2,75.56 | v62.87,88.27 IC6.7 | v62.87,98.42 v36.2,98.42 | v36.2,90.81 C10.1 | v36.2,90.81 32.38,90.81 | v36.2,90.81 36.2,75.56
N$1
  Bottom 0.406: C7.2 105.41,49.53 105.92,49.02 Q1.2 105.92,45.85 106.68,45.09 106.68,22.86 107.31,22.23 IC5.7
N$2
  Bottom 0.406: Q1.1 101.09,44.32 101.6,43.81 104.14,43.81 104.78,43.18 104.78,41.91 104.78,20.32 105.41,19.68 IC5.6
N$3
  Bottom 0.406: IC3.2 R4.1
N$4
  Bottom 0.406: 29.84,73.03 IC2.7 IC2.6 | 29.84,73.03 30.48,73.03 C4.+ | R2.1 29.84,73.03
N$5  (via drill 0.7)
  Top 0.406: v40.01,73.66 35.56,73.66 33.66,71.75 15.88,71.75 15.24,71.12 v15.24,70.48
  Bottom 0.406: IC2.3 v15.24,70.48 | IC1.1 v40.01,73.66
N$6  (via drill 0.7)
  Top 0.406: v18.41,81.92 v23.5,81.92
  Bottom 0.406: RESET.2 30.2,85.45 29.21,84.45 R1.1 26.67,82.55 26.04,81.92 v23.5,81.92 C3.2 | IC2.2 16.51,73.03 15.88,73.66 15.88,81.28 16.51,81.92 v18.41,81.92
N$8
  Bottom 0.406: JP1.2 104.78,53.34 105.41,52.7 107.95,52.7 108.58,52.07 108.58,30.48 109.22,29.84 IC5.10
N$9
  Bottom 0.406: IC3.4 R5.1
N$10
  Bottom 0.406: IC3.6 R6.1
N$11
  Bottom 0.406: R7.1 IC3.38
N$12
  Bottom 0.406: JP1.3 109.22,55.24 109.86,54.61 109.86,35.56 110.49,34.92 IC5.12
N$14
  Bottom 0.406: IC6.3 50.16,85.72 52.7,83.19 IC1.11
N$15
  Bottom 0.406: IC6.4 52.7,85.72 55.24,83.19 IC1.10
PHI2  (via drill 0.7)
  Top 0.406: v84.45,12.06 v84.45,42.55
  Bottom 0.406: IC3.39 30.48,52.7 31.75,51.44 31.75,46.99 32.38,46.35 73.03,46.35 73.66,46.35 | IC5.27 96.52,9.53 93.98,12.06 v84.45,12.06 | 73.66,46.35 83.82,46.35 84.45,45.72 v84.45,42.55 | IC6.5 55.24,92.71 55.88,93.34 73.03,93.34 73.66,92.71 73.66,46.35
R/!W  (via drill 0.7)
  Top 0.406: v70.48,9.53 v70.48,42.55 v70.48,64.14
  Bottom 0.406: IC5.28 94.61,6.99 93.98,7.62 93.98,10.16 93.34,10.79 79.38,10.79 78.11,9.53 IC8.27 v70.48,9.53 | IC3.34 27.3,40.01 28.57,41.27 57.15,41.27 58.42,42.55 v70.48,42.55 | v70.48,64.14 59.69,64.14 59.05,64.77 59.05,75.56 58.42,76.2 55.88,76.2 55.24,75.56
VCC  (via drill 0.7)
  Top 0.406: v44.45,6.99 v44.45,9.53 v44.45,43.81 | v17.14,6.99 v17.14,37.47 | v102.87,40.01 v102.87,5.08 | v42.55,66.67 v42.55,81.28 v42.55,95.89
  Bottom 0.406: J1.2 7.26,90.45 8.26,91.44 11.89,91.44 | 11.89,91.44 J1.3 | J1.2 7.26,80.36 8.26,79.38 QG1.14 12.06,68.58 12.7,67.94 IC2.4 18.41,64.14 | R1.2 26.04,78.74 IC2.8 24.13,75.56 23.5,74.93 23.5,67.31 25.4,65.41 R2.2 R7.2 41.91,55.24 42.55,55.88 42.55,63.5 v42.55,66.67 | 18.41,64.14 18.41,60.33 19.05,59.69 R3.2 | C2.2 18.41,64.14 | 2.54,55.24 R4.2 R5.2 R6.2 2.54,38.1 3.17,37.47 IC3.8 v17.14,37.47 | 2.54,55.24 2.54,87.63 3.17,88.27 J1.2 | C5.2 2.54,55.24 | v17.14,6.99 18.41,5.71 27.94,5.71 29.21,6.99 IC4.28 v44.45,6.99 48.9,6.99 50.16,8.26 68.58,8.26 69.85,6.99 IC8.28 78.11,6.99 79.38,8.26 92.08,8.26 92.71,7.62 92.71,5.71 93.34,5.08 v102.87,5.08 107.31,5.08 107.95,5.71 107.95,8.89 108.58,9.53 IC5.2 | IC4.27 v44.45,9.53 | v44.45,43.81 C6.2 46.99,44.45 47.62,45.09 76.2,45.09 76.83,44.45 C9.2 | C8.2 96.52,40.64 IC5.15 v102.87,40.01 | C11.2 40.01,66.04 40.64,66.67 v42.55,66.67 | IC7.14 v42.55,66.67 | C10.2 40.01,93.98 | 40.01,93.98 40.01,95.25 40.64,95.89 v42.55,95.89 IC6.14 | C1.2 40.01,80.64 40.64,81.28 v42.55,81.28 IC1.14 | 11.89,91.44 11.89,93.17 12.7,93.98 40.01,93.98